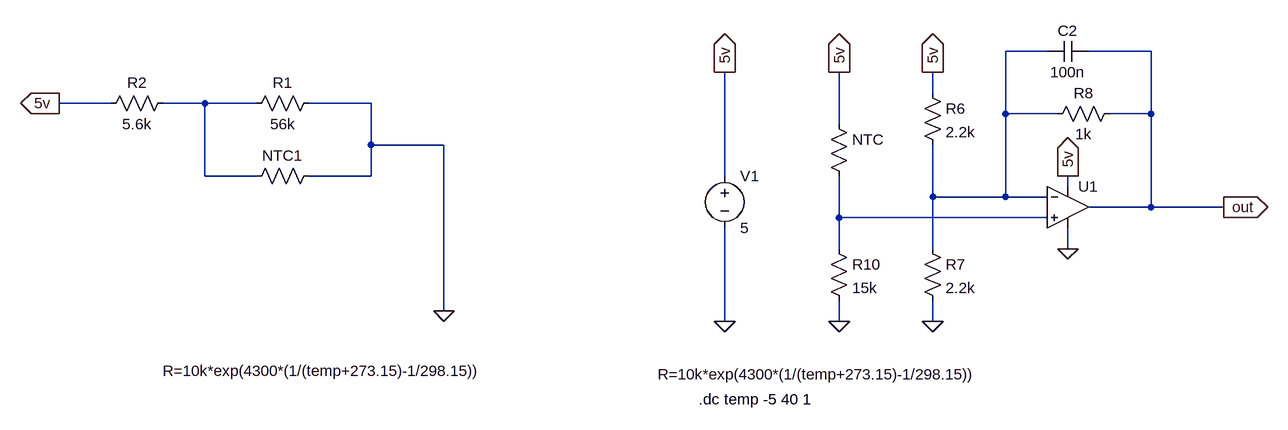
[diagram p0: schematic NTC.asc]
NTC.asc, the LTspice schematic file:
Version 4
SHEET 1 1456 1080
WIRE 1088 -64 1024 -64
WIRE 1248 -64 1152 -64
WIRE 912 0 912 -32
WIRE -352 16 -432 16
WIRE -208 16 -272 16
WIRE -128 16 -208 16
WIRE 48 16 -48 16
WIRE 1024 32 1024 -64
WIRE 1104 32 1024 32
WIRE 1248 32 1248 -64
WIRE 1248 32 1184 32
WIRE 768 48 768 -32
WIRE 48 80 48 16
WIRE 160 80 48 80
WIRE -208 128 -208 16
WIRE -128 128 -208 128
WIRE 48 128 48 80
WIRE 48 128 -48 128
WIRE 592 128 592 -32
WIRE 1120 144 1120 128
WIRE 912 160 912 80
WIRE 1024 160 1024 32
WIRE 1024 160 912 160
WIRE 1088 160 1024 160
WIRE 1248 176 1248 32
WIRE 1248 176 1152 176
WIRE 1360 176 1248 176
WIRE 768 192 768 128
WIRE 1088 192 768 192
WIRE 768 240 768 192
WIRE 912 240 912 160
WIRE 1120 240 1120 208
WIRE 160 336 160 80
WIRE 592 352 592 208
WIRE 768 352 768 320
WIRE 912 352 912 320
FLAG 592 352 0
FLAG 592 -32 5v
IOPIN 592 -32 Out
FLAG 1120 240 0
FLAG 1120 128 5v
IOPIN 1120 128 Out
FLAG 912 352 0
FLAG 768 352 0
FLAG 1360 176 out
IOPIN 1360 176 Out
FLAG 768 -32 5v
IOPIN 768 -32 Out
FLAG 912 -32 5v
IOPIN 912 -32 Out
FLAG -432 16 5v
IOPIN -432 16 Out
FLAG 160 336 0
SYMBOL voltage 592 112 R0
WINDOW 123 0 0 Left 0
WINDOW 39 0 0 Left 0
SYMATTR InstName V1
SYMATTR Value 5
SYMBOL res 896 -16 R0
SYMATTR InstName R6
SYMATTR Value 2.2k
SYMBOL res 896 224 R0
SYMATTR InstName R7
SYMATTR Value 2.2k
SYMBOL res 1200 16 R90
WINDOW 0 0 56 VBottom 2
WINDOW 3 32 56 VTop 2
SYMATTR InstName R8
SYMATTR Value 1k
SYMBOL res 752 32 R0
WINDOW 3 -263 401 Left 2
SYMATTR Value R=10k*exp(4300*(1/(temp+273.15)-1/298.15))
SYMATTR InstName NTC
SYMBOL res 752 224 R0
SYMATTR InstName R10
SYMATTR Value 15k
SYMBOL cap 1152 -80 R90
WINDOW 0 0 32 VBottom 2
WINDOW 3 32 32 VTop 2
SYMATTR InstName C2
SYMATTR Value 100n
SYMBOL OpAmps\\UniversalOpAmp 1120 176 R0
SYMATTR InstName U1
SYMBOL res -32 112 R90
WINDOW 3 300 -8 VTop 2
WINDOW 0 0 56 VBottom 2
SYMATTR Value R=10k*exp(4300*(1/(temp+273.15)-1/298.15))
SYMATTR InstName NTC1
SYMBOL res -32 0 R90
WINDOW 0 0 56 VBottom 2
WINDOW 3 32 56 VTop 2
SYMATTR InstName R1
SYMATTR Value 56k
SYMBOL res -256 0 R90
WINDOW 0 0 56 VBottom 2
WINDOW 3 32 56 VTop 2
SYMATTR InstName R2
SYMATTR Value 5.6k
TEXT 552 472 Left 2 !.dc temp -5 40 1

The netlist it stands for:
* NTC.asc
V1 5v 0 5
R6 5v N001 2.2k
R7 N001 0 2.2k
R8 out N001 1k
R§NTC 5v N003 R=10k*exp(4300*(1/(temp+273.15)-1/298.15))
R10 N003 0 15k
C2 out N001 100n
XU1 N003 N001 5v 0 out level1 Avol=1Meg GBW=10Meg Vos=0 En=0 Enk=0 In=0 Ink=0 Rin=500Meg  ; pins In+ In- V+ V- OUT
R§NTC1 0 N002 R=10k*exp(4300*(1/(temp+273.15)-1/298.15))
R1 0 N002 56k
R2 N002 5v 5.6k
.dc temp -5 40 1
.lib UniversalOpAmp1.lib
.backanno
.end